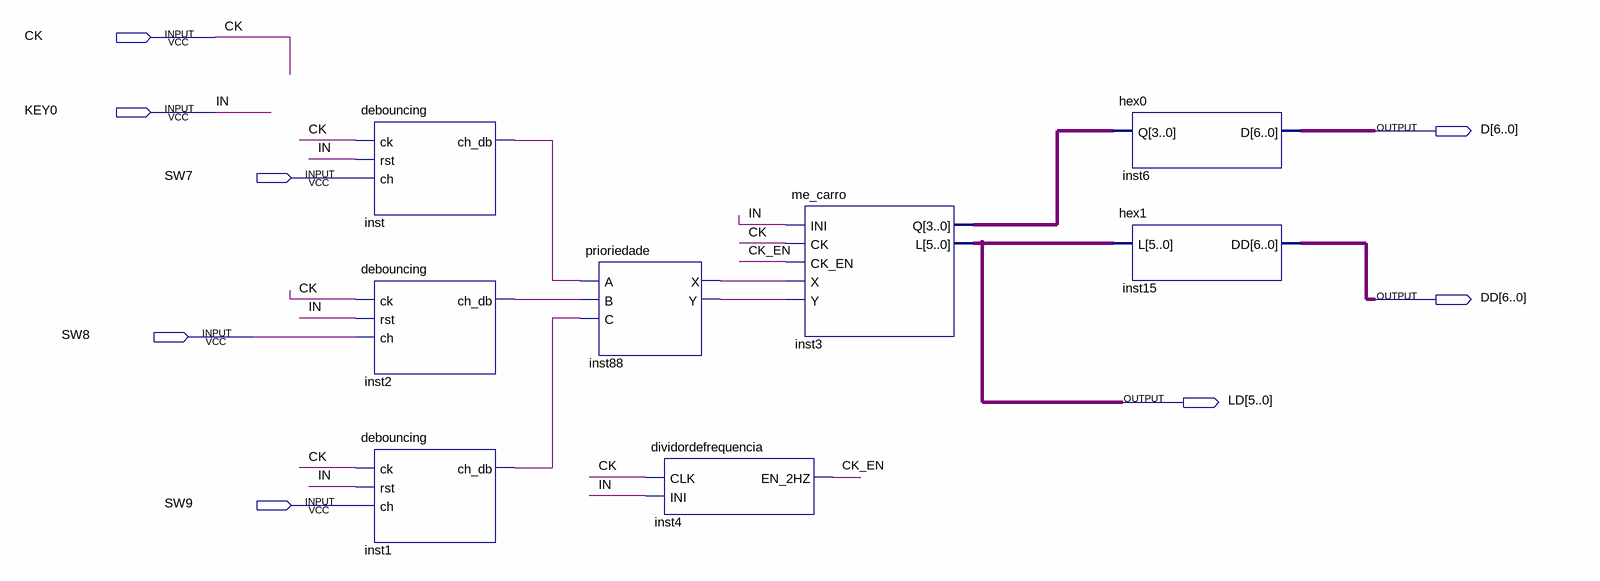
[diagram p0: schematic sheet]
// Quartus schematic Block1.bdf as structural Verilog: 8 symbols, 8 pins
module Block1 (
  input  CK,
  input  KEY0,
  input  SW7,
  input  SW8,
  input  SW9,
  output [6:0] D,
  output [6:0] DD,
  output [5:0] LD
);

  wire CK_EN, inst1_ch_db, inst2_ch_db, inst88_x, inst88_y, inst_ch_db;
  wire [3:0] inst3_q;

  debouncing inst (.ck(CK), .rst(KEY0), .ch(SW7), .ch_db(inst_ch_db));
  debouncing inst2 (.ck(CK), .rst(KEY0), .ch(SW8), .ch_db(inst2_ch_db));
  debouncing inst1 (.ck(CK), .rst(KEY0), .ch(SW9), .ch_db(inst1_ch_db));
  prioriedade inst88 (.A(inst_ch_db), .B(inst2_ch_db), .C(inst1_ch_db), .X(inst88_x), .Y(inst88_y));
  dividordefrequencia inst4 (.CLK(CK), .INI(KEY0), .EN_2HZ(CK_EN));
  me_carro inst3 (.INI(KEY0), .CK(CK), .CK_EN(CK_EN), .X(inst88_x), .Y(inst88_y), .Q(inst3_q), .L(LD));
  hex0 inst6 (.Q(inst3_q), .D(D));
  hex1 inst15 (.L(LD), .DD(DD));

  // Other names for the same wires on the sheet: IN = KEY0
endmodule
